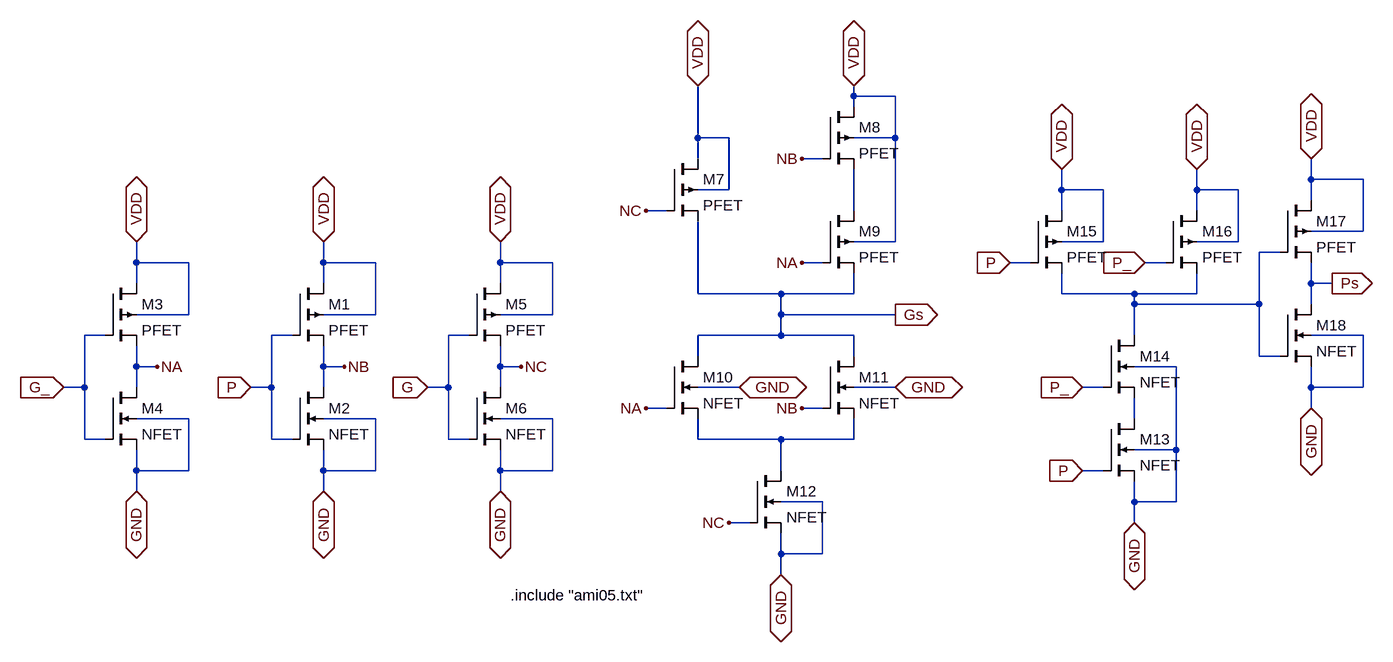
[diagram p0: schematic black.asc]
black.asc, the LTspice schematic file:
Version 4
SHEET 1 2316 680
WIRE 1328 -304 1328 -320
WIRE 1392 -304 1328 -304
WIRE 1328 -288 1328 -304
WIRE 1088 -240 1088 -320
WIRE 1136 -240 1088 -240
WIRE 1392 -240 1392 -304
WIRE 1392 -240 1328 -240
WIRE 1088 -208 1088 -240
WIRE 1280 -208 1248 -208
WIRE 2032 -176 2032 -208
WIRE 2112 -176 2032 -176
WIRE 1136 -160 1136 -240
WIRE 1136 -160 1088 -160
WIRE 1648 -160 1648 -192
WIRE 1712 -160 1648 -160
WIRE 1856 -160 1856 -192
WIRE 1920 -160 1856 -160
WIRE 2032 -144 2032 -176
WIRE 1040 -128 1008 -128
WIRE 1328 -128 1328 -192
WIRE 1648 -128 1648 -160
WIRE 1856 -128 1856 -160
WIRE 2112 -96 2112 -176
WIRE 2112 -96 2032 -96
WIRE 1392 -80 1392 -240
WIRE 1392 -80 1328 -80
WIRE 1712 -80 1712 -160
WIRE 1712 -80 1648 -80
WIRE 1920 -80 1920 -160
WIRE 1920 -80 1856 -80
WIRE 1984 -64 1952 -64
WIRE 224 -48 224 -80
WIRE 304 -48 224 -48
WIRE 512 -48 512 -80
WIRE 592 -48 512 -48
WIRE 784 -48 784 -80
WIRE 864 -48 784 -48
WIRE 1280 -48 1248 -48
WIRE 1600 -48 1568 -48
WIRE 1808 -48 1776 -48
WIRE 224 -16 224 -48
WIRE 512 -16 512 -48
WIRE 784 -16 784 -48
WIRE 2032 -16 2032 -48
WIRE 2064 -16 2032 -16
WIRE 1088 0 1088 -112
WIRE 1216 0 1088 0
WIRE 1328 0 1328 -32
WIRE 1328 0 1216 0
WIRE 1648 0 1648 -32
WIRE 1760 0 1648 0
WIRE 1856 0 1856 -32
WIRE 1856 0 1760 0
WIRE 1760 16 1760 0
WIRE 1952 16 1952 -64
WIRE 1952 16 1760 16
WIRE 2032 16 2032 -16
WIRE 304 32 304 -48
WIRE 304 32 224 32
WIRE 592 32 592 -48
WIRE 592 32 512 32
WIRE 864 32 864 -48
WIRE 864 32 784 32
WIRE 1216 32 1216 0
WIRE 1392 32 1216 32
WIRE 176 64 144 64
WIRE 464 64 432 64
WIRE 736 64 704 64
WIRE 1216 64 1216 32
WIRE 1216 64 1088 64
WIRE 1328 64 1216 64
WIRE 1760 64 1760 16
WIRE 2112 64 2032 64
WIRE 1088 96 1088 64
WIRE 1328 96 1328 64
WIRE 1952 96 1952 16
WIRE 1984 96 1952 96
WIRE 224 112 224 80
WIRE 256 112 224 112
WIRE 512 112 512 80
WIRE 544 112 512 112
WIRE 784 112 784 80
WIRE 816 112 784 112
WIRE 1824 112 1760 112
WIRE 144 144 144 64
WIRE 144 144 112 144
WIRE 224 144 224 112
WIRE 432 144 432 64
WIRE 432 144 400 144
WIRE 512 144 512 112
WIRE 704 144 704 64
WIRE 704 144 672 144
WIRE 784 144 784 112
WIRE 1152 144 1088 144
WIRE 1392 144 1328 144
WIRE 1712 144 1680 144
WIRE 2032 144 2032 112
WIRE 2112 144 2112 64
WIRE 2112 144 2032 144
WIRE 1040 176 1008 176
WIRE 1280 176 1248 176
WIRE 2032 176 2032 144
WIRE 304 192 224 192
WIRE 592 192 512 192
WIRE 864 192 784 192
WIRE 1760 192 1760 160
WIRE 144 224 144 144
WIRE 176 224 144 224
WIRE 432 224 432 144
WIRE 464 224 432 224
WIRE 704 224 704 144
WIRE 736 224 704 224
WIRE 1088 224 1088 192
WIRE 1216 224 1088 224
WIRE 1328 224 1328 192
WIRE 1328 224 1216 224
WIRE 1824 240 1824 112
WIRE 1824 240 1760 240
WIRE 224 272 224 240
WIRE 304 272 304 192
WIRE 304 272 224 272
WIRE 512 272 512 240
WIRE 592 272 592 192
WIRE 592 272 512 272
WIRE 784 272 784 240
WIRE 864 272 864 192
WIRE 864 272 784 272
WIRE 1216 272 1216 224
WIRE 1712 272 1680 272
WIRE 224 304 224 272
WIRE 512 304 512 272
WIRE 784 304 784 272
WIRE 1280 320 1216 320
WIRE 1760 320 1760 288
WIRE 1824 320 1824 240
WIRE 1824 320 1760 320
WIRE 1168 352 1136 352
WIRE 1760 352 1760 320
WIRE 1216 400 1216 368
WIRE 1280 400 1280 320
WIRE 1280 400 1216 400
WIRE 1216 432 1216 400
FLAG 512 -80 VDD
IOPIN 512 -80 BiDir
FLAG 512 304 GND
IOPIN 512 304 BiDir
FLAG 544 112 NB
FLAG 400 144 P
IOPIN 400 144 In
FLAG 224 -80 VDD
IOPIN 224 -80 BiDir
FLAG 224 304 GND
IOPIN 224 304 BiDir
FLAG 256 112 NA
FLAG 672 144 G
IOPIN 672 144 In
FLAG 784 -80 VDD
IOPIN 784 -80 BiDir
FLAG 784 304 GND
IOPIN 784 304 BiDir
FLAG 816 112 NC
FLAG 112 144 G_
IOPIN 112 144 In
FLAG 1088 -320 VDD
IOPIN 1088 -320 BiDir
FLAG 1328 -320 VDD
IOPIN 1328 -320 BiDir
FLAG 1152 144 GND
IOPIN 1152 144 BiDir
FLAG 1392 144 GND
IOPIN 1392 144 BiDir
FLAG 1216 432 GND
IOPIN 1216 432 BiDir
FLAG 1248 -208 NB
FLAG 1248 176 NB
FLAG 1248 -48 NA
FLAG 1008 176 NA
FLAG 1008 -128 NC
FLAG 1136 352 NC
FLAG 1392 32 Gs
IOPIN 1392 32 Out
FLAG 1760 352 GND
IOPIN 1760 352 BiDir
FLAG 1856 -192 VDD
IOPIN 1856 -192 BiDir
FLAG 1648 -192 VDD
IOPIN 1648 -192 BiDir
FLAG 1680 272 P
IOPIN 1680 272 In
FLAG 1776 -48 P_
IOPIN 1776 -48 In
FLAG 1568 -48 P
IOPIN 1568 -48 In
FLAG 1680 144 P_
IOPIN 1680 144 In
FLAG 2064 -16 Ps
IOPIN 2064 -16 Out
FLAG 2032 -208 VDD
IOPIN 2032 -208 BiDir
FLAG 2032 176 GND
IOPIN 2032 176 BiDir
SYMBOL pmos4 464 -16 R0
SYMATTR InstName M1
SYMATTR Value PFET
SYMATTR Value2 l=0.6u w=3u
SYMBOL nmos4 464 144 R0
SYMATTR InstName M2
SYMATTR Value NFET
SYMATTR Value2 l=0.6u w=1.5u
SYMBOL pmos4 176 -16 R0
SYMATTR InstName M3
SYMATTR Value PFET
SYMATTR Value2 l=0.6u w=3u
SYMBOL nmos4 176 144 R0
SYMATTR InstName M4
SYMATTR Value NFET
SYMATTR Value2 l=0.6u w=1.5u
SYMBOL pmos4 736 -16 R0
SYMATTR InstName M5
SYMATTR Value PFET
SYMATTR Value2 l=0.6u w=3u
SYMBOL nmos4 736 144 R0
SYMATTR InstName M6
SYMATTR Value NFET
SYMATTR Value2 l=0.6u w=1.5u
SYMBOL pmos4 1040 -208 R0
SYMATTR InstName M7
SYMATTR Value PFET
SYMATTR Value2 l=0.6u w=6u
SYMBOL pmos4 1280 -288 R0
SYMATTR InstName M8
SYMATTR Value PFET
SYMATTR Value2 l=0.6u w=6u
SYMBOL pmos4 1280 -128 R0
SYMATTR InstName M9
SYMATTR Value PFET
SYMATTR Value2 l=0.6u w=6u
SYMBOL nmos4 1040 96 R0
SYMATTR InstName M10
SYMATTR Value NFET
SYMATTR Value2 l=0.6u w=3u
SYMBOL nmos4 1280 96 R0
SYMATTR InstName M11
SYMATTR Value NFET
SYMATTR Value2 l=0.6u w=3u
SYMBOL nmos4 1168 272 R0
SYMATTR InstName M12
SYMATTR Value NFET
SYMATTR Value2 l=0.6u w=3u
SYMBOL nmos4 1712 192 R0
SYMATTR InstName M13
SYMATTR Value NFET
SYMATTR Value2 l=0.6u w=3u
SYMBOL nmos4 1712 64 R0
SYMATTR InstName M14
SYMATTR Value NFET
SYMATTR Value2 l=0.6u w=3u
SYMBOL pmos4 1600 -128 R0
SYMATTR InstName M15
SYMATTR Value PFET
SYMATTR Value2 l=0.6u w=3u
SYMBOL pmos4 1808 -128 R0
SYMATTR InstName M16
SYMATTR Value PFET
SYMATTR Value2 l=0.6u w=3u
SYMBOL pmos4 1984 -144 R0
SYMATTR InstName M17
SYMATTR Value PFET
SYMATTR Value2 l=0.6u w=3u
SYMBOL nmos4 1984 16 R0
SYMATTR InstName M18
SYMATTR Value NFET
SYMATTR Value2 l=0.6u w=1.5u
TEXT 800 464 Left 2 !.include "ami05.txt"

The netlist it stands for:
* black.asc
M1 VDD P NB VDD PFET l=0.6u w=3u
M2 NB P GND GND NFET l=0.6u w=1.5u
M3 VDD G_ NA VDD PFET l=0.6u w=3u
M4 NA G_ GND GND NFET l=0.6u w=1.5u
M5 VDD G NC VDD PFET l=0.6u w=3u
M6 NC G GND GND NFET l=0.6u w=1.5u
M7 VDD NC Gs VDD PFET l=0.6u w=6u
M8 VDD NB N001 VDD PFET l=0.6u w=6u
M9 N001 NA Gs VDD PFET l=0.6u w=6u
M10 Gs NA N004 GND NFET l=0.6u w=3u
M11 Gs NB N004 GND NFET l=0.6u w=3u
M12 N004 NC GND GND NFET l=0.6u w=3u
M13 N003 P GND GND NFET l=0.6u w=3u
M14 N002 P_ N003 GND NFET l=0.6u w=3u
M15 VDD P N002 VDD PFET l=0.6u w=3u
M16 VDD P_ N002 VDD PFET l=0.6u w=3u
M17 VDD N002 Ps VDD PFET l=0.6u w=3u
M18 Ps N002 GND GND NFET l=0.6u w=1.5u
.model NMOS NMOS
.model PMOS PMOS
.lib standard.mos
.include "ami05.txt"
.backanno
.end